# EAGLE design NT_RadioModule (EAGLE 9.2.2)
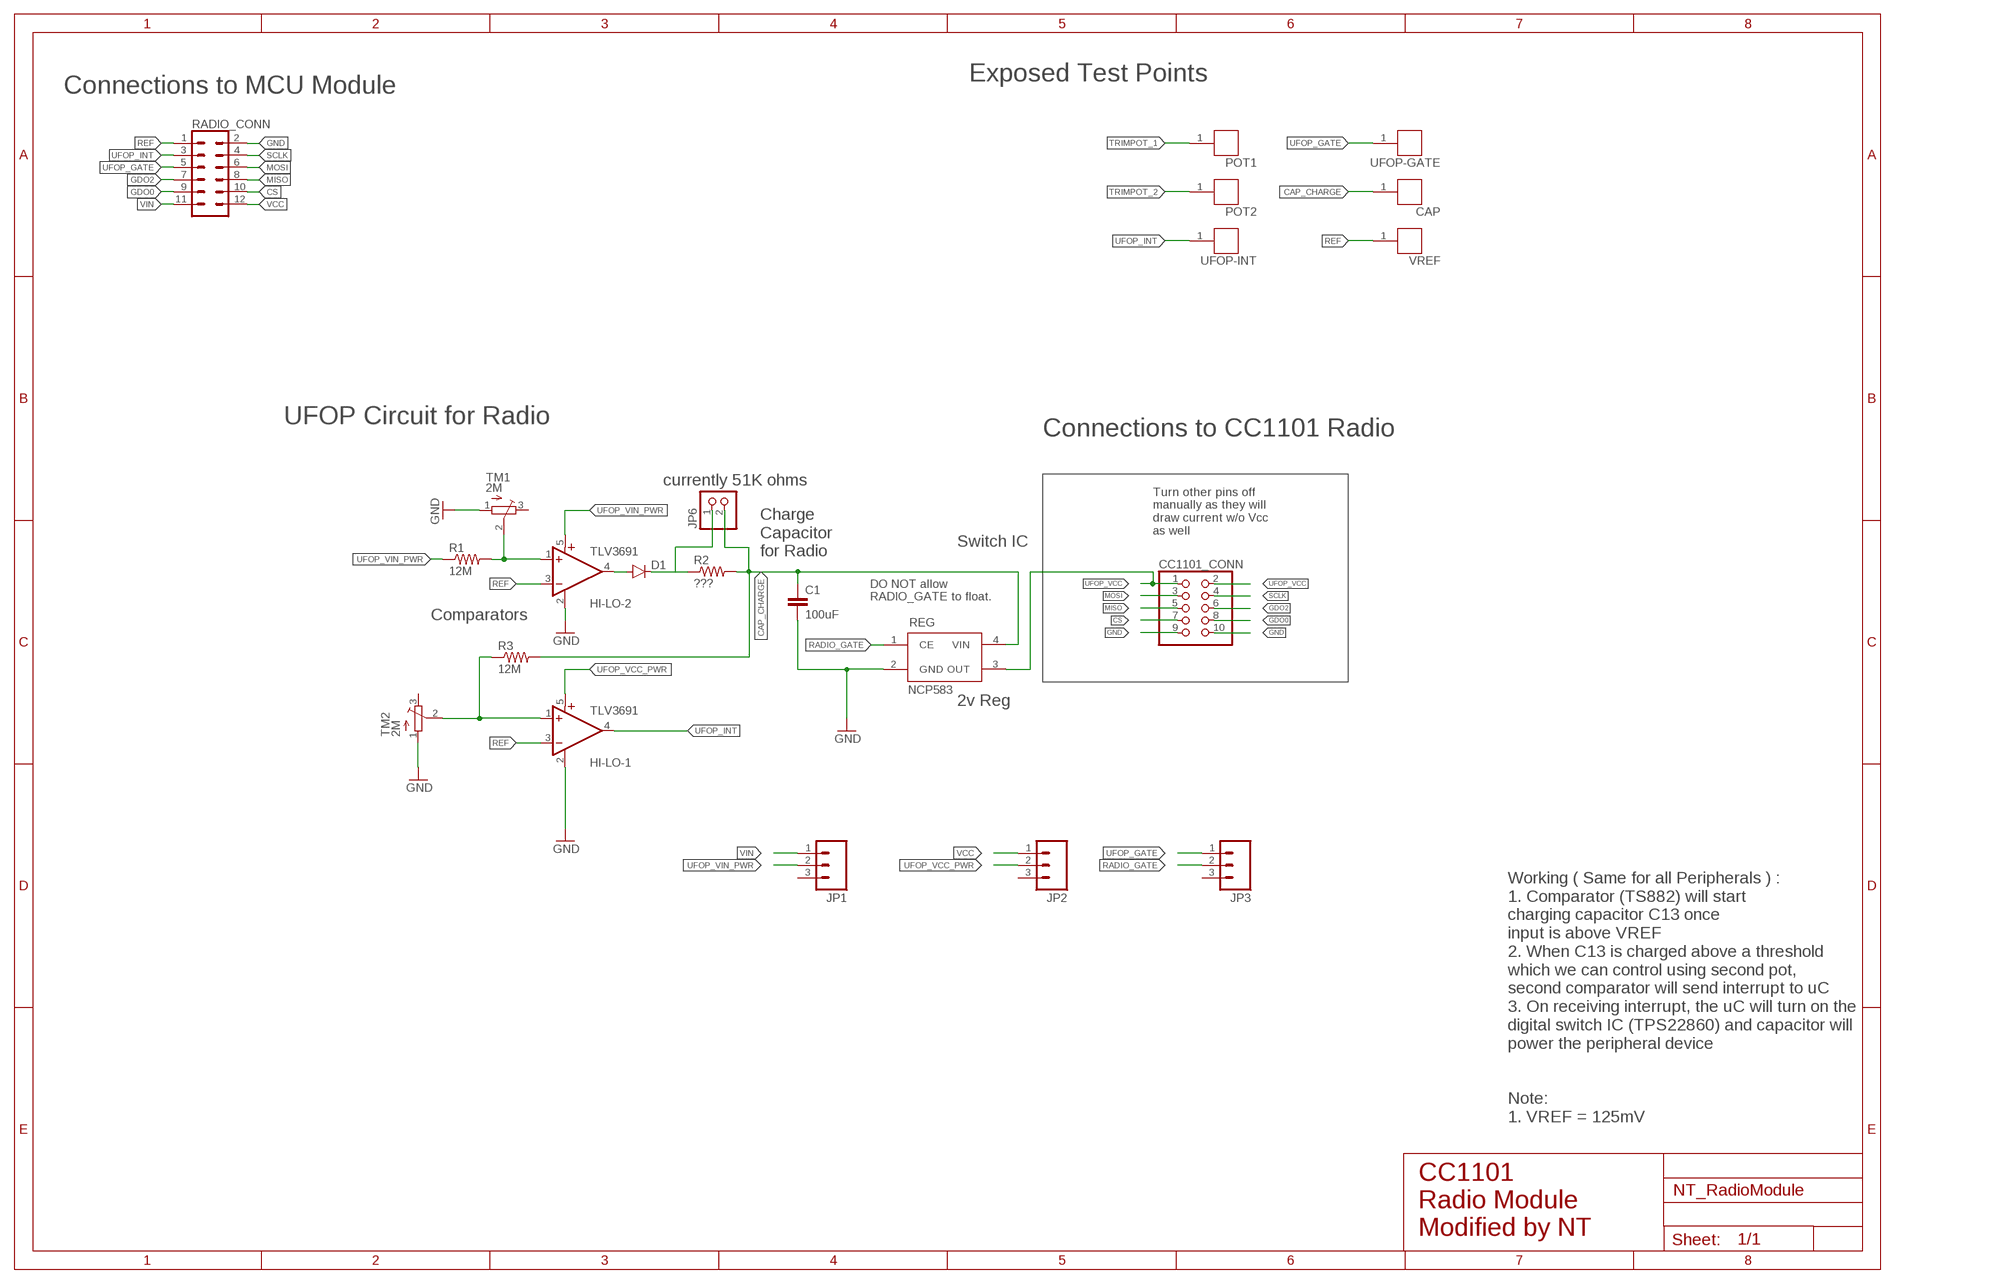
[diagram p0: schematic, sheet 1]

## Parts
C1  100uF  CAP0603-CAP  [0603-CAP]
CAP  RCU-0C  [TE_RCU-0C]
CC1101_CONN  PINHD-2X5  [2X05]
D1  DIODESOD523  [SOD523]
HI-LO-1  TLV3691  [SC70-5]
HI-LO-2  TLV3691  [SC70-5]
JP1  M03  [1X03-1.27MM]
JP2  M03  [1X03-1.27MM]
JP3  M03  [1X03-1.27MM]
JP6  PINHD-1X2  [1X02]
POT1  RCU-0C  [TE_RCU-0C]
POT2  RCU-0C  [TE_RCU-0C]
R1  12M  RESISTOR0603  [0603-RES]
R2  ???  RESISTOR0603  [0603-RES]
R3  12M  RESISTOR0603  [0603-RES]
RADIO_CONN  CONN_06X2PTH_FEMALE  [2X6]
REG  NCP583  [SC82-AB_1PRIMARY]
TM1  2M  TRIMPOTTC33X  [TC33X]
TM2  2M  TRIMPOTTC33X  [TC33X]
UFOP-GATE  RCU-0C  [TE_RCU-0C]
UFOP-INT  RCU-0C  [TE_RCU-0C]
VREF  RCU-0C  [TE_RCU-0C]

## Nets
CAP_CHARGE: C1.1 CAP.1 JP6.2 R2.2 R3.2 REG.4(VIN)
CS: CC1101_CONN.7 RADIO_CONN.10
GDO0: CC1101_CONN.8 RADIO_CONN.9
GDO2: CC1101_CONN.6 RADIO_CONN.7
GND: C1.2 CC1101_CONN.9 CC1101_CONN.10 HI-LO-1.2(GND) HI-LO-2.2(GND) RADIO_CONN.2 REG.2(GND) TM1.1(A) TM2.1(A)
MISO: CC1101_CONN.5 RADIO_CONN.8
MOSI: CC1101_CONN.3 RADIO_CONN.6
N$1: D1.C JP6.1 R2.1
N$24: D1.A HI-LO-2.4(OUT)
RADIO_GATE: JP3.2 REG.1(CE)
REF: HI-LO-1.3(-IN) HI-LO-2.3(-IN) RADIO_CONN.1 VREF.1
SCLK: CC1101_CONN.4 RADIO_CONN.4
TRIMPOT_1: HI-LO-2.1(+IN) POT1.1 R1.2 TM1.2(S)
TRIMPOT_2: HI-LO-1.1(+IN) POT2.1 R3.1 TM2.2(S)
UFOP_GATE: JP3.1 RADIO_CONN.5 UFOP-GATE.1
UFOP_INT: HI-LO-1.4(OUT) RADIO_CONN.3 UFOP-INT.1
UFOP_VCC: CC1101_CONN.1 CC1101_CONN.2 REG.3(OUT)
UFOP_VCC_PWR: HI-LO-1.5(V+) JP2.2
UFOP_VIN_PWR: HI-LO-2.5(V+) JP1.2 R1.1
VCC: JP2.1 RADIO_CONN.12
VIN: JP1.1 RADIO_CONN.11
Unconnected: JP1.3 JP2.3 JP3.3 TM1.3(E) TM2.3(E)

## Notes on the sheet
- Exposed Test Points
- Connections to MCU Module
- UFOP Circuit for Radio
- Connections to CC1101 Radio
- currently 51K ohms
- Charge 
  Capacitor 
  for Radio
- Turn other pins off 
  manually as they will
  draw current w/o Vcc
  as well
- Switch IC
- DO NOT allow 
  RADIO_GATE to float.
- Comparators
- 2v Reg
- Working ( Same for all Peripherals ) :
  1. Comparator (TS882) will start 
  charging capacitor C13 once 
  input is above VREF
  2. When C13 is charged above a threshold
  which we can control using second pot, 
  second comparator will send interrupt to uC
  3. On receiving interrupt, the uC will turn on the
  digital switch IC (TPS22860) and capacitor will 
  power the peripheral device
- Note:
  1. VREF = 125mV
- CC1101
  Radio Module
  Modified by NT

## Library data of the parts
C1 = SparkFun-Capacitors:CAP: Capacitor Standard 0603 ceramic capacitor, and 0.1" leaded capacitor.; DIGIKEY: 490-9969-1-ND
CAP POT1 POT2 UFOP-GATE UFOP-INT VREF = RCU-0C:RCU-0C: 0603 PROBE PAD; AVAILABILITY: Unavailable; COMMENT: RCU-0C _1625854-3_; DESCRIPTION: 0603 PROBE PAD; EU_ROHS_COMPLIANCE: Compliant; LINK: http://www.te.com/usa-en/product-1625854-3.html; MF: TE Connectivity; MP: RCU-0C; PACKAGE: 0603; POWER_RATING: 0 W; PRICE: None; RESISTANCE: <.05; TOLERANCE: 0%
CC1101_CONN = pinhead:PINHD-2X5: PIN HEADER
D1 = SparkFun-DiscreteSemi:DIODE: Diode These are standard reverse protection diodes and small signal diodes. SMA package can handle up to about 1A. SOD-323 can handle about 200mA. What the SOD-323 package when ordering, there are some mfgs out there that are 5-pin packages.
HI-LO-1 HI-LO-2 = fedpower:TLV3691: 0.9-V to 6.5-V, Nanopower Comparator Datasheets Analog Signal Chain Guide <http://www.ti.com/lit/pdf/slyb174> TLV3691 <http://www.ti.com/lit/ds/symlink/tlv3691.pdf> Manufacturer Product Page TLV3691IDPFR Specifications <http://www.ti.com/general/docs/suppproductinfo.tsp?distId=10&orderablePartNumber=TLV3691IDPFR> Standard Package <javascript:dlgHelp('Standard%20Packaging%20Help');> 1 Category Integrated Circuits (ICs) </product-search/en/integrated-circuits-ics> Family Linear - Comparators </product-search/en/integrated-circuits-ics/linear-comparators/2556221> Series - Packaging <javascript:dlgHelp('Standard%20Packaging%20Help');> Cut Tape (CT) <javascript:dlgHelp('Cut%20Tape%20Help');> Type General Purpose Number of Elements 1 Output Type Push-Pull Voltage - Supply, Single/Dual (±) 0.9 V ~ 6.5 V, ±0.45 V ~ 3.25 V Voltage - Input Offset (Max) 3mV Current - Input Bias (Max) 100pA Current - Output (Typ) 42mA Current - Quiescent (Max) 150nA CMRR, PSRR (Typ) - Propagation Delay (Max) 35µs Hysteresis - Operating Temperature -40°C ~ 125°C Package / Case 6-XFDFN Mounting Type Surface Mount Supplier Device Package 6-X2SON (1x1) Online Catalog Comparators - 1 element </catalog/en/partgroup/comparators-1-element/3112?mpart=TLV3691IDPFR&vendor=296&WT.z_ref_page_type=PS&WT.z_ref_page_sub_type=PD&WT.z_ref_page_id=PD&WT.z_ref_page_event=DC_Link_Table> Other Names 296-37242-1
JP1-JP3 = SparkFun-Connectors:M03: Header 3 Standard 3-pin 0.1" header. Use with straight break away headers (SKU : PRT-00116), right angle break away headers (PRT-00553), swiss pins (PRT-00743), machine pins (PRT-00117), and female headers (PRT-00115). Molex polarized connector foot print use with SKU : PRT-08232 with associated crimp pins and housings.
JP6 = pinhead:PINHD-1X2: PIN HEADER
R1 = SparkFun-Resistors:RESISTOR: Resistor Basic schematic elements and footprints for 0603, 1206, and PTH resistors.
R2 R3 = SparkFun-Resistors:RESISTOR: Resistor Basic schematic elements and footprints for 0603, 1206, and PTH resistors.; DIGIKEY: 311-2.00MHRCT-ND
RADIO_CONN = SparkFun-Connectors:CONN_06X2: Multi connection point. Often used as Generic Header-pin footprint for 0.1 inch spaced/style header connections On any of the 0.1 inch spaced packages, you can populate with these: Break Away Headers - Straight <https://www.sparkfun.com/products/116> (PRT-00116) Break Away Male Headers - Right Angle <https://www.sparkfun.com/products/553> (PRT-00553) Female Headers <https://www.sparkfun.com/products/115> (PRT-00115) Break Away Headers - Machine Pin <https://www.sparkfun.com/products/117> (PRT-00117) Break Away Female Headers - Swiss Machine Pin <https://www.sparkfun.com/products/743> (PRT-00743); PROD_ID: CONN-12423; VALUE: 2X6 FEMALE
REG = ncp583:NCP583: NCP583 - Ultra-Low Iq 150 mA CMOS LDO Regulator with Enable The NCP583 series of low dropout regulators are designed for portable battery powered applications which require precise output voltage accuracy and low quiescent current. These devices feature an enable function which lowers current consumption significantly and are offered in two small packages; SC−82AB and the SOT−563. A 1.0 mF ceramic capacitor is the recommended value to be used with these devices on the output pin.
TM1 TM2 = adafruit:TRIMPOT: SMT trimmer potentiometer part number TC33X http://www.ladyada.net/library/eagle

## Board
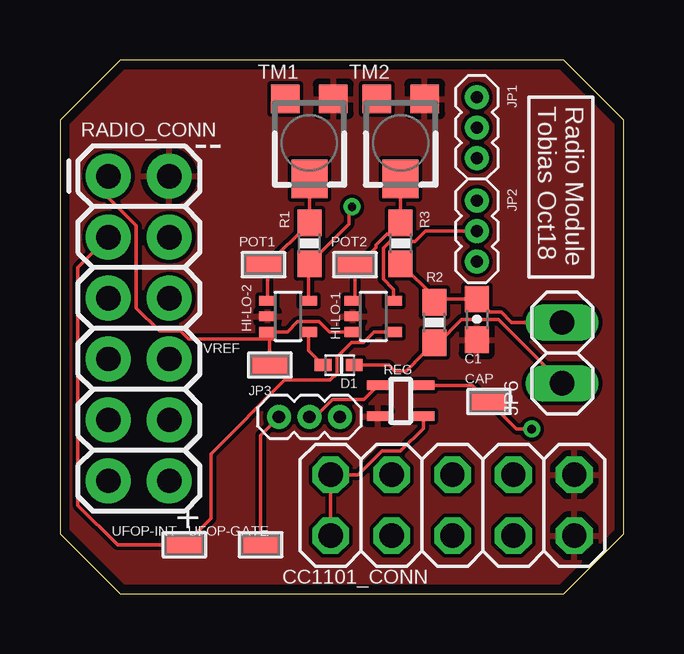
[diagram p1: board, top side]
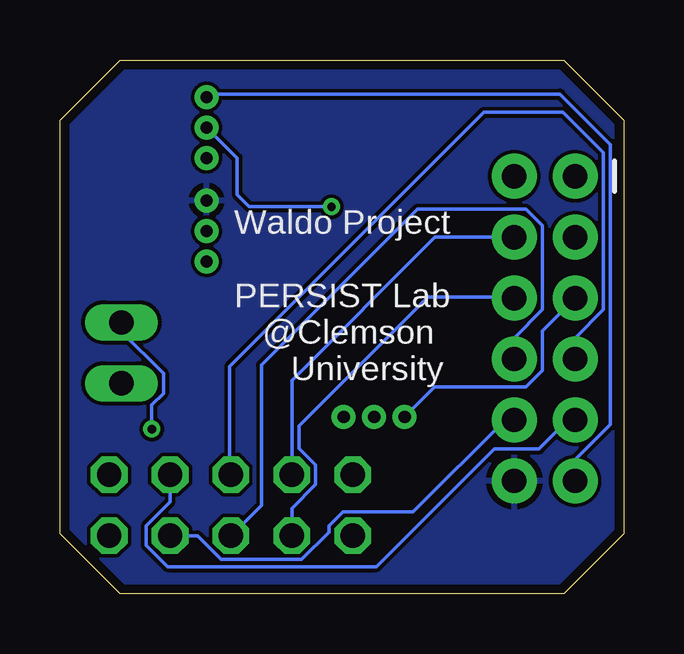
[diagram p2: board, bottom side, seen from below]

Size 23.5 x 22.25 mm. Coordinates in mm from the lower left corner, seen from the top.
Outline: 21,22.25 2.5,22.25 0,19.75 0,2.5 2.5,0 21,0 23.5,2.5 23.5,19.75 21,22.25
Copper layers (1*16): Top 0.0356mm / dielectric 1.5011mm / Bottom 0.0356mm
Design rules "oshpark-2layer *": minimum track width 6mil, minimum drill 13mil, track to track 6mil, track to pad 6mil, pad to pad 6mil, via to via 6mil, smd to smd 6mil, copper to edge 15mil, drill to drill 6mil, minimum pad ring 7mil, minimum via ring 7mil, stop-mask expansion 2.5mil, vias tented up to drill 14mil, thermal gap 10mil

### Footprints (pad centres in the part's own frame; a part is rotated, then mirrored left to right if it is on the bottom)
0603-CAP = smd 1.1 x 1: 1 -0.85,0; 2 0.85,0
TE_RCU-0C = smd 1.6 x 0.8: 1 0,0
2X05 = drill 1.016 octagon: 1 -5.08,-1.27; 2 -5.08,1.27; 3 -2.54,-1.27; 4 -2.54,1.27; 5 0,-1.27; 6 0,1.27; 7 2.54,-1.27; 8 2.54,1.27; 9 5.08,-1.27; 10 5.08,1.27
SOD523 = smd 0.7 x 0.5: A 0.7,0; C -0.6,0
SC70-5 = smd 0.4 x 0.7: 1 -0.65,-0.85; 2 0,-0.85; 3 0.65,-0.85; 4 0.65,0.85; 5 -0.65,0.85
1X03-1.27MM = drill 0.508 pad 1: 1 -1.27,0; 2 0,0; 3 1.27,0
1X02 = drill 1.016 long: 1 -1.27,0; 2 1.27,0
0603-RES = smd 1.1 x 1: 1 -0.85,0; 2 0.85,0
2X6 = drill 1.016 pad 1.88: 1 0,0; 2 0,2.54; 3 2.54,0; 4 2.54,2.54; 5 5.08,0; 6 5.08,2.54; 7 7.62,0; 8 7.62,2.54; 9 10.16,0; 10 10.16,2.54; 11 12.7,0; 12 12.7,2.54
SC82-AB_1PRIMARY = smd 0.406 x 0.914: 1 -1.321,-0.813; 2 -0.025,-0.813; 3 -0.025,1.067; 4 -1.321,1.067
TC33X = smd 1.2 x 1.2: 1 -1,-1.825; 3 1,-1.825 | smd 1.5 x 1.6: 2 0,1.5

### Placement (x,y rotation side)
C1  17.38,11.43 270 top
CAP  17.89,8 0 top
CC1101_CONN  16.37,3.68 0 top
D1  11.67,9.53 180 top
HI-LO-1  13.06,11.56 270 top
HI-LO-2  9.51,11.56 270 top
JP1  17.38,19.43 270 top
JP2  17.38,15.11 270 top
JP3  10.4,7.37 0 top
JP6  20.94,10.03 90 top
POT1  8.49,13.72 180 top
POT2  12.3,13.72 0 top
R1  10.4,14.61 90 top
R2  15.61,11.3 90 top
R3  14.21,14.61 270 top
RADIO_CONN  2.02,17.4 270 top
REG  14.08,7.37 270 top
TM1  10.4,18.8 180 top
TM2  14.21,18.8 180 top
UFOP-GATE  8.37,2.03 0 top
UFOP-INT  5.19,2.03 0 top
VREF  8.75,9.53 0 top

### Tracks (layer width: path | path; a pad name or v marks a point on that pad's centre or on a via)
CAP_CHARGE  (via drill 0.35)
  Top 0.152: R3.2 15.61,12.36 R2.2 15.73,12.28 C1.1 17.93,11.73 18.4,11.73 18.83,11.3 JP6.2 | REG.4 17.21,8.69 CAP.1 19.03,6.86 v19.67,6.86
  Bottom 0.152: v19.67,6.86 19.67,7.87 19.19,8.35 19.19,9.17 20.94,10.93 JP6.2
CS
  Bottom 0.152: CC1101_CONN.7 17.77,2.41 16.78,1.42 13.42,1.42 12.28,2.56 12.28,2.82 11.7,3.4 8.77,3.4 4.94,7.24 RADIO_CONN.10
GDO0
  Bottom 0.152: CC1101_CONN.8 18.91,3.81 19.9,2.82 19.9,2 19.01,1.12 10.29,1.12 5.38,6.03 3.53,6.03 2.32,7.24 RADIO_CONN.9
GDO2
  Bottom 0.152: RADIO_CONN.7 2.02,10.67 0.85,11.84 0.85,18.39 2.52,20.07 5.83,20.07 16.42,9.47 16.42,5 CC1101_CONN.6
GND
  pour Top: -3.83,24.13 29.19,24.13 29.19,-1.27 -3.83,-1.27
MISO
  Bottom 0.152: CC1101_CONN.5 15.1,3.68 15.1,9.53 8.6,16.03 4.07,16.03 3.39,15.34 3.39,11.84 4.56,10.67 RADIO_CONN.8
MOSI
  Bottom 0.152: CC1101_CONN.3 13.83,3.55 12.84,4.54 12.84,5.36 13.52,6.05 13.52,6.99 8.15,12.36 4.59,12.36 RADIO_CONN.6
N$1
  Top 0.152: D1.C 13.71,9.53 13.95,9.29 14.45,9.29 14.8,9.64 14.8,9.65 R2.1 15.77,10.45 16.75,11.43 18.27,11.43 JP6.1
N$24
  Top 0.152: HI-LO-2.4 10.36,10.13 D1.A
RADIO_GATE
  Top 0.152: JP3.2 10.63,7.37 11.36,8.1 12.68,8.1 REG.1
REF
  Top 0.152: 8.75,10.82 HI-LO-2.3 | 8.75,10.82 8.95,10.62 5.37,10.62 5.04,10.95 4.15,10.95 3.18,11.91 3.18,15.34 2.02,16.51 RADIO_CONN.1 | 8.75,10.82 VREF.1 | 8.75,10.82 8.84,10.91 9.49,10.91 9.91,11.34 10.8,11.34 11.23,10.91 HI-LO-1.3
SCLK
  Bottom 0.152: CC1101_CONN.4 13.83,8.89 7.86,14.86 RADIO_CONN.4
TRIMPOT_1
  Top 0.152: TM1.2 R1.2 8.66,13.72 POT1.1 8.66,13.55 HI-LO-2.1
TRIMPOT_2
  Top 0.152: TM2.2 R3.1 13.73,14.98 13.63,14.98 13.18,14.53 13.18,14.42 12.47,13.72 POT2.1 12.3,12.29 HI-LO-1.1
UFOP_GATE
  Top 0.152: JP3.1 8.37,6.6 UFOP-GATE.1
  Bottom 0.152: JP3.1 7.88,8.61 4.07,8.61 3.39,9.29 3.39,10.95 RADIO_CONN.5
UFOP_INT
  Top 0.152: HI-LO-1.4 13.09,10.91 12.66,10.48 12.15,10.48 11.55,9.87 11.55,9.18 11.26,8.9 9.37,8.9 6.29,5.82 6.29,3.13 UFOP-INT.1 4.56,2.03 4.17,2.03 2.4,2.03 0.75,3.68 0.75,13.59 RADIO_CONN.3
UFOP_VCC
  Top 0.152: CC1101_CONN.1 CC1101_CONN.2 12.43,4.95 13.42,5.94 14.21,5.94 15.15,6.88 REG.3
UFOP_VCC_PWR
  Top 0.152: HI-LO-1.5 13.91,12.68 13.48,13.11 13.48,14.4 13.76,14.68 14.8,14.68 15.24,15.11 JP2.2
UFOP_VIN_PWR  (via drill 0.35)
  Top 0.152: HI-LO-2.5 10.36,13.72 R1.1 12.05,15.41 12.05,16 v12.18,16.13
  Bottom 0.152: JP1.2 16.11,18.16 16.11,16.64 15.61,16.13 v12.18,16.13
VCC
  pour Bottom: -6.37,25.4 30.46,25.4 30.46,-1.27 -6.37,-1.27
VIN
  Bottom 0.152: JP1.1 17.26,20.83 2.65,20.83 0.54,18.72 0.54,7.06 2.02,5.59 RADIO_CONN.11

### Text on the board
tPlace: Radio Module / Tobias Oct18 | -- | +
bPlace: Waldo Project / / PERSIST Lab / @Clemson / University